# Altium schematic sheet Power Distribution - External ADC.SchDoc: External ADC
size B; Organization: Midnight Sun Solar Rayce Car Team; Address1: University of Waterloo; Address2: 200 University Ave W; Address3: Waterloo, ON, Canada; Address4: N2L 3E9; DocumentNumber: 7; SheetNumber: 7; SheetTotal: 13; Website: www.uwmidsun.com; ProjectName: ProjectName
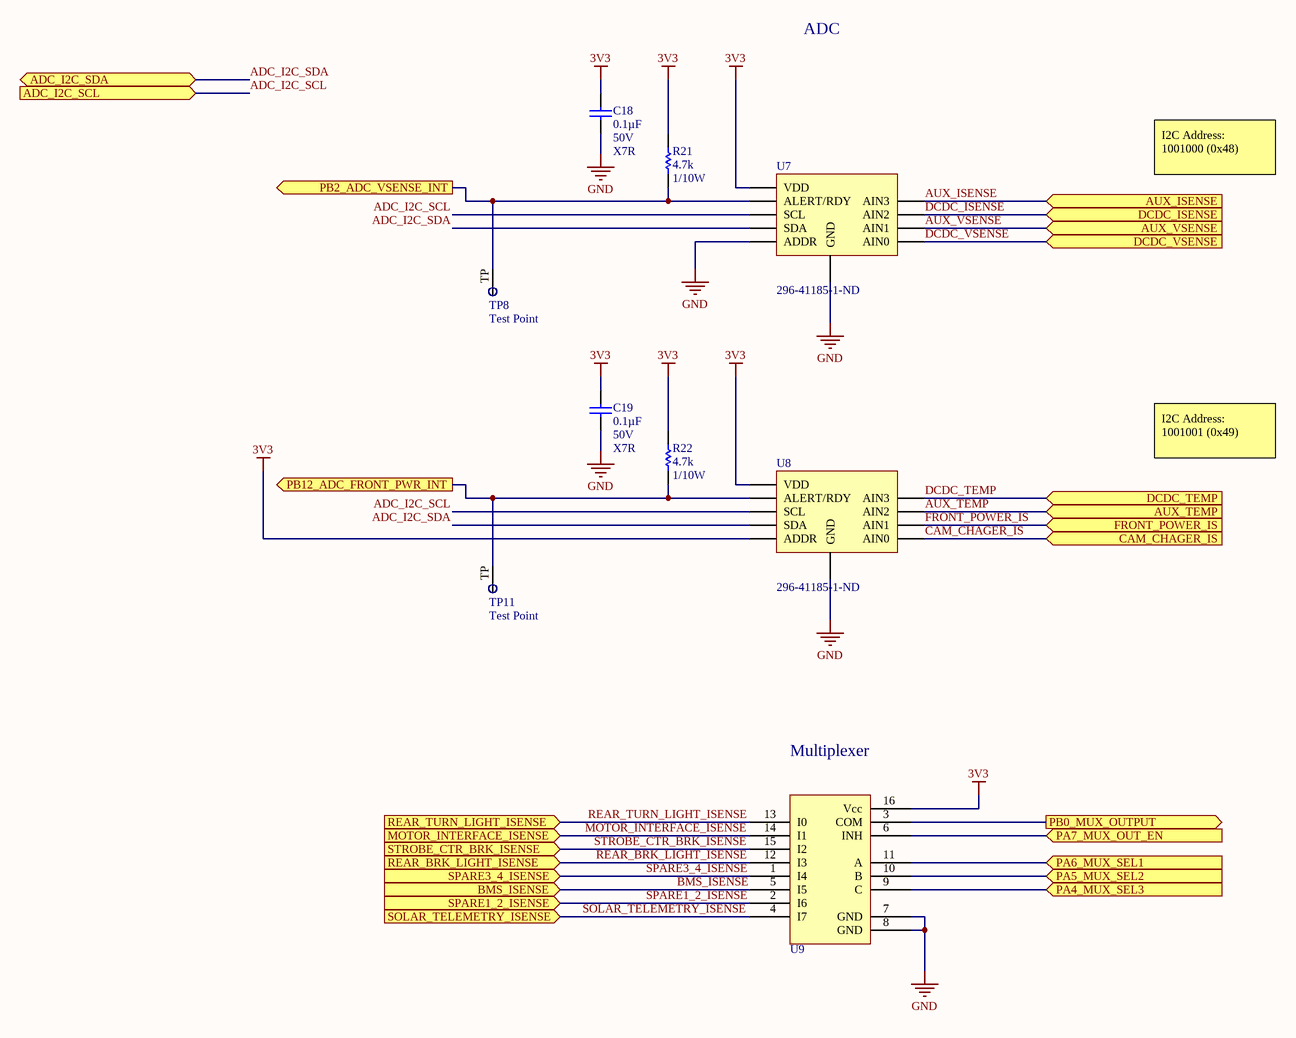
[diagram p0: Power Distribution - External ADC.SchDoc]

## Parts
C18  Capacitance: 0.1µF  Voltage: 50V  Temperature Coefficient: X7R  [CAP, 0603]  (hidden comment: CAP CER 0.1UF 50V 10% X7R 0603)
C19  Capacitance: 0.1µF  Voltage: 50V  Temperature Coefficient: X7R  [CAP, 0603]  (hidden comment: CAP CER 0.1UF 50V 10% X7R 0603)
R21  Resistance (Ohms): 4.7k  Power (Watts): 1/10W  [RES, 0603]  (hidden comment: RES 4.7K OHM 1% 1/10W 0603)
R22  Resistance (Ohms): 4.7k  Power (Watts): 1/10W  [RES, 0603]  (hidden comment: RES 4.7K OHM 1% 1/10W 0603)
TP8  Test Point  [Test Point]  (no BOM)
TP11  Test Point  [Test Point]  (no BOM)
U7  Supplier Part Number 1: 296-41185-1-ND  [IC ADC VSSOP10]  (hidden comment: Quad ADC)
U8  Supplier Part Number 1: 296-41185-1-ND  [IC ADC VSSOP10]  (hidden comment: Quad ADC)
U9  IC MUX/DMUX 8X1 16TSSOP  [16-TSSOP]  (value not drawn)

## Ports
ADC_I2C_SCL (in), ADC_I2C_SDA (bidir), AUX_ISENSE (in), AUX_TEMP (in), AUX_VSENSE (in), BMS_ISENSE (in), CAM_CHAGER_IS (in), DCDC_ISENSE (in), DCDC_TEMP (in), DCDC_VSENSE (in), FRONT_POWER_IS (in), MOTOR_INTERFACE_ISENSE (in), PA4_MUX_SEL3 (in), PA5_MUX_SEL2 (in), PA6_MUX_SEL1 (in), PA7_MUX_OUT_EN (in), PB0_MUX_OUTPUT (out), PB2_ADC_VSENSE_INT (out), PB12_ADC_FRONT_PWR_INT (out), REAR_BRK_LIGHT_ISENSE (in), REAR_TURN_LIGHT_ISENSE (in), SOLAR_TELEMETRY_ISENSE (in), SPARE1_2_ISENSE (in), SPARE3_4_ISENSE (in), STROBE_CTR_BRK_ISENSE (in)

## Nets
3V3: C18.1 C19.1 R21.1 R22.1 U7.8(VDD) U8.1(ADDR) U8.8(VDD) U9.16(Vcc)
GND: C18.2 C19.2 U7.1(ADDR) U7.3(GND) U8.3(GND) U9.7(GND) U9.8(GND)
ADC_I2C_SCL: U7.10(SCL) U8.10(SCL) ; port ADC_I2C_SCL
ADC_I2C_SDA: U7.9(SDA) U8.9(SDA) ; port ADC_I2C_SDA
AUX_ISENSE: U7.7(AIN3) ; port AUX_ISENSE
AUX_TEMP: U8.6(AIN2) ; port AUX_TEMP
AUX_VSENSE: U7.5(AIN1) ; port AUX_VSENSE
BMS_ISENSE: U9.5(I5) ; port BMS_ISENSE
CAM_CHAGER_IS: U8.4(AIN0) ; port CAM_CHAGER_IS
DCDC_ISENSE: U7.6(AIN2) ; port DCDC_ISENSE
DCDC_TEMP: U8.7(AIN3) ; port DCDC_TEMP
DCDC_VSENSE: U7.4(AIN0) ; port DCDC_VSENSE
FRONT_POWER_IS: U8.5(AIN1) ; port FRONT_POWER_IS
MOTOR_INTERFACE_ISENSE: U9.14(I1) ; port MOTOR_INTERFACE_ISENSE
PA4_MUX_SEL3: U9.9(C) ; port PA4_MUX_SEL3
PA5_MUX_SEL2: U9.10(B) ; port PA5_MUX_SEL2
PA6_MUX_SEL1: U9.11(A) ; port PA6_MUX_SEL1
PA7_MUX_OUT_EN: U9.6(INH) ; port PA7_MUX_OUT_EN
PB0_MUX_OUTPUT: U9.3(COM) ; port PB0_MUX_OUTPUT
PB2_ADC_VSENSE_INT: R21.2 TP8.TP U7.2(ALERT/RDY) ; port PB2_ADC_VSENSE_INT
PB12_ADC_FRONT_PWR_INT: R22.2 TP11.TP U8.2(ALERT/RDY) ; port PB12_ADC_FRONT_PWR_INT
REAR_BRK_LIGHT_ISENSE: U9.12(I3) ; port REAR_BRK_LIGHT_ISENSE
REAR_TURN_LIGHT_ISENSE: U9.13(I0) ; port REAR_TURN_LIGHT_ISENSE
SOLAR_TELEMETRY_ISENSE: U9.4(I7) ; port SOLAR_TELEMETRY_ISENSE
SPARE1_2_ISENSE: U9.2(I6) ; port SPARE1_2_ISENSE
SPARE3_4_ISENSE: U9.1(I4) ; port SPARE3_4_ISENSE
STROBE_CTR_BRK_ISENSE: U9.15(I2) ; port STROBE_CTR_BRK_ISENSE

## Notes on the sheet
- ADC
- I2C Address: 1001000 (0x48)
- I2C Address: 1001001 (0x49)
- (near U9) Multiplexer
- PROJECT
- DOCUMENT
- DRAWN BY
- LAST MODIFIED
- PART NUMBER
- REVISION
- SHEET
- VARIANT
- OF
- Engineering 5 - 1002
  University of Waterloo
  (519) 888-4567 x32978
  hardware@uwmidsun.com

## Library data of the parts
C18 C19 = CAP CER 0.1UF 50V 10% X7R 0603: 0.10µF ±10% 50V Ceramic Capacitor X7R 0603 (1608 Metric); Manufacturer 1: AVX Corporation; Manufacturer Part Number 1: 06035C104KAT2A; Supplier 1: Digi-Key; Supplier Part Number 1: 478-5052-1-ND; Packaging: Cut Tape (CT); Part Status: Active; Operating Temperature: -55°C ~ 125°C; Ratings: -; Mounting Type: Surface Mount, MLCC; Package / Case: 0603 (1608 Metric); Size / Dimension: 0.063" L x 0.032" W (1.60mm x 0.81mm); Height - Seated (Max): -; Thickness (Max): 0.035" (0.90mm); Lead Spacing: -; Lead Style: -; ComponentLink1URL: http://datasheets.avx.com/X7RDielectric.pdf; ComponentLink1Description: http://datasheets.avx.com/X7RDielectric.pdf; Tolerance: ±10%
R21 R22 = RES 4.7K OHM 1% 1/10W 0603: 4.7k Ohm ±1% 0.1W, 1/10W Chip Resistor 0603 (1608 Metric) Moisture Resistant Thick Film; Manufacturer 1: Yageo; Manufacturer Part Number 1: RC0603FR-074K7L; Description 1: RES SMD 4.7K OHM 1% 1/10W 0603; Temperature Coefficient: ±100ppm/°C; Supplier 1: Digi-Key; Supplier Part Number 1: 311-4.70KHRCT-ND; RoHS: RoHS Compliant; Category: Resistors; Stock 1: 3487566; Pricing 1: 1=0.16, 10=0.022, 100=0.0089, 1000=0.00402, 2500=0.00349 (CAD); Packaging: Cut Tape (CT); Part Status: Active; Composition: Thick Film; Features: Moisture Resistant; Operating Temperature: -55°C ~ 155°C; Package / Case: 0603 (1608 Metric); Supplier Device Package: 0603; Size / Dimension: 0.063" L x 0.031" W (1.60mm x 0.80mm); Height - Seated (Max): 0.022" (0.55mm); Failure Rate: -; ComponentLink1URL: http://www.yageo.com/documents/recent/PYu-RC_Group_51_RoHS_L_7.pdf; ComponentLink1Description: http://www.yageo.com/documents/recent/PYu-RC_Group_51_RoHS_L_7.pdf; Tolerance: ±1%
U7 U8 = IC ADC 12-BIT VSSOP-10: 12 Bit Analog to Digital Converter 4 Input 1 Sigma-Delta 10-VSSOP; Manufacturer: Texas Instruments; Manufacturer Part Number: ADS1015IDGSR; Number of Bits: 12; Sampling Rate (Per Second): 3.3k; Number of Inputs: 2, 4; Input Type: Differential, Single Ended; Data Interface: I²C; Configuration: MUX-PGA-ADC; Number of A/D Converters: 1; Reference Type: Internal; Voltage - Supply, Analog: 2 V ~ 5.5 V; Supplier 1: Digi-Key; RoHS: RoHS Compliant; Category: Integrated Circuits (ICs); Stock 1: 4084; Pricing 1: 1=4.25, 10=3.807, 100=3.1194, 500=2.65552, 1000=2.23959 (CAD); Packaging: Cut Tape (CT); Part Status: Active; Ratio - S/H:ADC: -; Architecture: Sigma-Delta; Voltage - Supply, Digital: 2 V ~ 5.5 V; Features: PGA, Selectable Address; Operating Temperature: -40°C ~ 125°C; Package / Case: 10-TFSOP, 10-MSOP (0.118", 3.00mm Width); Supplier Device Package: 10-VSSOP; ComponentLink1URL: http://www.ti.com/lit/ds/symlink/ads1013.pdf; ComponentLink1Description: http://www.ti.com/lit/ds/symlink/ads1013.pdf
U9 = IC MUX/DMUX 8X1 16TSSOP: 1 Circuit IC Switch 8:1 75Ohm 16-TSSOP; Manufacturer: Texas Instruments; Number of Circuits: 1; Voltage - Supply, Single (V+): 2V ~ 5.5V; Channel-to-Channel Matching (ΔRon): 1.3Ohm; -3db Bandwidth: 35MHz; Switch Time (Ton, Toff) (Max): 14ns, 14ns; Channel Capacitance (CS(off), CD(off)): 0.5pF, 23.4pF; Current - Leakage (IS(off)) (Max): 100nA; Series: Automotive, AEC-Q100; Packaging: Cut Tape (CT); Part Status: Active; Multiplexer/Demultiplexer Circuit: 8:1; On-State Resistance (Max): 75Ohm; Voltage - Supply, Dual (V±): -; Crosstalk: -; Operating Temperature: -40°C ~ 125°C (TA); Charge Injection: -; Package / Case: 16-TSSOP (0.173", 4.40mm Width); Supplier Device Package: 16-TSSOP; Switch Circuit: -; Supplier 1: Digi-Key; Supplier Part Number 1: 296-29043-1-ND; ComponentLink1Description: http://www.ti.com/lit/ds/symlink/sn74lv4051a-q1.pdf; ComponentLink1URL: http://www.ti.com/lit/ds/symlink/sn74lv4051a-q1.pdf